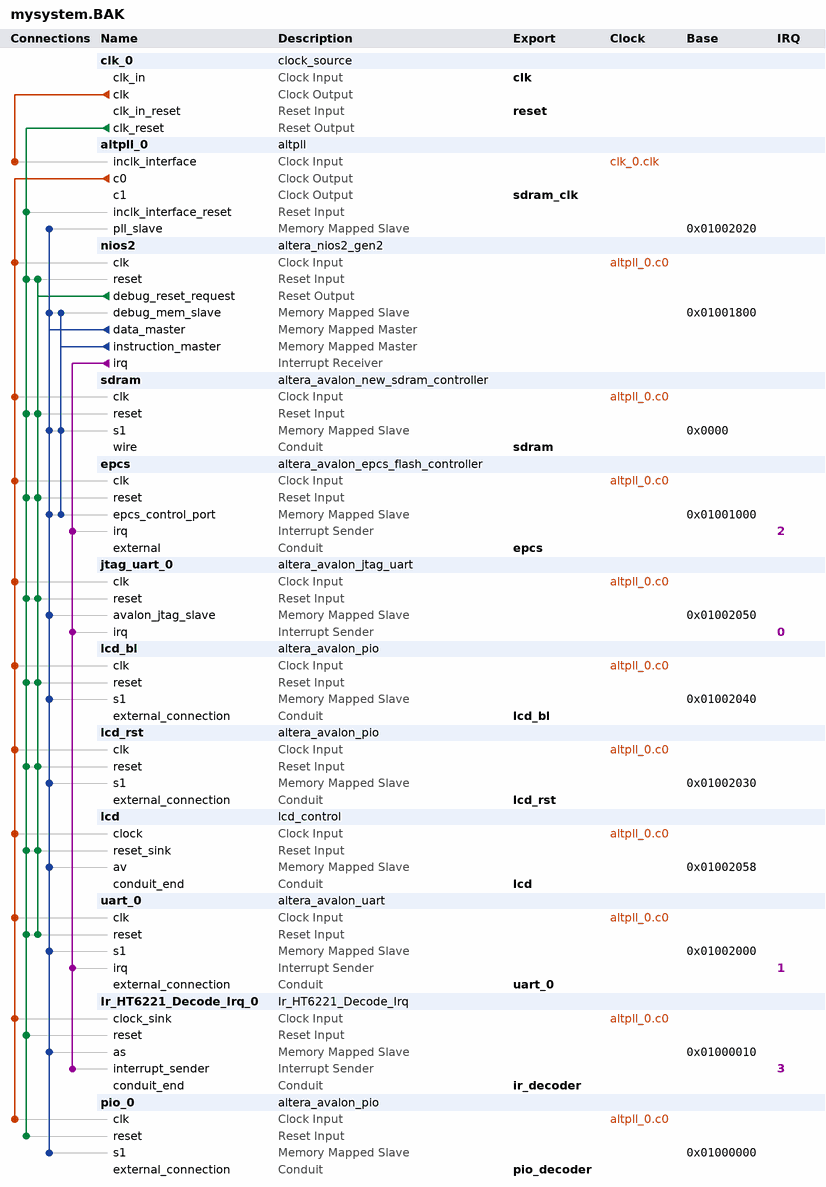
[diagram p0: system contents]
# Platform Designer (Qsys) system mysystem.BAK, Cyclone IV E EP4CE10F17C8
# Parameters at their usual value, and those the tool derives, are not listed.
package require -exact qsys 17.1
create_system mysystem.BAK
set_project_property DEVICE_FAMILY {Cyclone IV E}
set_project_property DEVICE EP4CE10F17C8

add_instance clk_0 clock_source 17.1
set_instance_parameter_value clk_0 clockFrequency 50000000

add_instance altpll_0 altpll 17.1
set_instance_parameter_value altpll_0 CLK0_DIVIDE_BY 1
set_instance_parameter_value altpll_0 CLK0_MULTIPLY_BY 2
set_instance_parameter_value altpll_0 CLK1_DIVIDE_BY 1
set_instance_parameter_value altpll_0 CLK1_DUTY_CYCLE 50
set_instance_parameter_value altpll_0 CLK1_MULTIPLY_BY 2
set_instance_parameter_value altpll_0 CLK1_PHASE_SHIFT -2500
set_instance_parameter_value altpll_0 INCLK0_INPUT_FREQUENCY 20000
set_instance_parameter_value altpll_0 PORT_ARESET PORT_UNUSED
set_instance_parameter_value altpll_0 PORT_LOCKED PORT_UNUSED
set_instance_parameter_value altpll_0 PORT_clk1 PORT_USED
set_instance_parameter_value altpll_0 PORT_clk2 PORT_UNUSED
set_instance_parameter_value altpll_0 PORT_clk3 PORT_UNUSED

add_instance nios2 altera_nios2_gen2 17.1
set_instance_parameter_value nios2 dcache_size 2048
set_instance_parameter_value nios2 exceptionSlave sdram.s1
set_instance_parameter_value nios2 icache_size 4096
set_instance_parameter_value nios2 impl Fast
set_instance_parameter_value nios2 resetSlave epcs.epcs_control_port
set_instance_parameter_value nios2 setting_activateTrace true

add_instance sdram altera_avalon_new_sdram_controller 17.1
set_instance_parameter_value sdram TAC 5.5
set_instance_parameter_value sdram TRCD 20.0
set_instance_parameter_value sdram TRP 20.0
set_instance_parameter_value sdram casLatency 3
set_instance_parameter_value sdram columnWidth 9
set_instance_parameter_value sdram dataWidth 16
set_instance_parameter_value sdram generateSimulationModel false
set_instance_parameter_value sdram model single_Micron_MT48LC4M32B2_7_chip
set_instance_parameter_value sdram numberOfBanks 4
set_instance_parameter_value sdram numberOfChipSelects 1
set_instance_parameter_value sdram powerUpDelay 100.0
set_instance_parameter_value sdram refreshPeriod 15.625
set_instance_parameter_value sdram rowWidth 12

add_instance epcs altera_avalon_epcs_flash_controller 17.1
set_instance_parameter_value epcs resetrequest_enabled true

add_instance jtag_uart_0 altera_avalon_jtag_uart 17.1
set_instance_parameter_value jtag_uart_0 simInteractiveOptions NO_INTERACTIVE_WINDOWS

add_instance lcd_bl altera_avalon_pio 17.1
set_instance_parameter_value lcd_bl direction Output
set_instance_parameter_value lcd_bl resetValue 1
set_instance_parameter_value lcd_bl width 1

add_instance lcd_rst altera_avalon_pio 17.1
set_instance_parameter_value lcd_rst direction Output
set_instance_parameter_value lcd_rst resetValue 1
set_instance_parameter_value lcd_rst width 1

add_instance lcd lcd_control 1.0

add_instance uart_0 altera_avalon_uart 17.1
set_instance_parameter_value uart_0 baud 115200
set_instance_parameter_value uart_0 dataBits 8
set_instance_parameter_value uart_0 fixedBaud false
set_instance_parameter_value uart_0 parity NONE
set_instance_parameter_value uart_0 stopBits 1

add_instance Ir_HT6221_Decode_Irq_0 Ir_HT6221_Decode_Irq 1.0
set_instance_parameter_value Ir_HT6221_Decode_Irq_0 N_Code 32
set_instance_parameter_value Ir_HT6221_Decode_Irq_0 N_Dev 20
set_instance_parameter_value Ir_HT6221_Decode_Irq_0 T_Clk50m 10
set_instance_parameter_value Ir_HT6221_Decode_Irq_0 T_Sa_Clk 10000

add_instance pio_0 altera_avalon_pio 17.1
set_instance_parameter_value pio_0 direction Input
set_instance_parameter_value pio_0 width 32

# connections
add_connection altpll_0.c0 epcs.clk clock
add_connection altpll_0.c0 Ir_HT6221_Decode_Irq_0.clock_sink clock
add_connection altpll_0.c0 jtag_uart_0.clk clock
add_connection altpll_0.c0 lcd.clock clock
add_connection altpll_0.c0 lcd_bl.clk clock
add_connection altpll_0.c0 lcd_rst.clk clock
add_connection altpll_0.c0 nios2.clk clock
add_connection altpll_0.c0 pio_0.clk clock
add_connection altpll_0.c0 sdram.clk clock
add_connection altpll_0.c0 uart_0.clk clock
add_connection clk_0.clk altpll_0.inclk_interface clock
add_connection clk_0.clk_reset altpll_0.inclk_interface_reset reset
add_connection clk_0.clk_reset epcs.reset reset
add_connection clk_0.clk_reset Ir_HT6221_Decode_Irq_0.reset reset
add_connection clk_0.clk_reset jtag_uart_0.reset reset
add_connection clk_0.clk_reset lcd.reset_sink reset
add_connection clk_0.clk_reset lcd_bl.reset reset
add_connection clk_0.clk_reset lcd_rst.reset reset
add_connection clk_0.clk_reset nios2.reset reset
add_connection clk_0.clk_reset pio_0.reset reset
add_connection clk_0.clk_reset sdram.reset reset
add_connection clk_0.clk_reset uart_0.reset reset
add_connection nios2.debug_reset_request epcs.reset reset
add_connection nios2.debug_reset_request jtag_uart_0.reset reset
add_connection nios2.debug_reset_request lcd.reset_sink reset
add_connection nios2.debug_reset_request lcd_bl.reset reset
add_connection nios2.debug_reset_request lcd_rst.reset reset
add_connection nios2.debug_reset_request nios2.reset reset
add_connection nios2.debug_reset_request sdram.reset reset
add_connection nios2.debug_reset_request uart_0.reset reset
add_connection nios2.data_master altpll_0.pll_slave avalon
set_connection_parameter_value nios2.data_master/altpll_0.pll_slave baseAddress 0x01002020
add_connection nios2.data_master epcs.epcs_control_port avalon
set_connection_parameter_value nios2.data_master/epcs.epcs_control_port baseAddress 0x01001000
add_connection nios2.data_master Ir_HT6221_Decode_Irq_0.as avalon
set_connection_parameter_value nios2.data_master/Ir_HT6221_Decode_Irq_0.as baseAddress 0x01000010
add_connection nios2.data_master jtag_uart_0.avalon_jtag_slave avalon
set_connection_parameter_value nios2.data_master/jtag_uart_0.avalon_jtag_slave baseAddress 0x01002050
add_connection nios2.data_master lcd.av avalon
set_connection_parameter_value nios2.data_master/lcd.av baseAddress 0x01002058
add_connection nios2.data_master lcd_bl.s1 avalon
set_connection_parameter_value nios2.data_master/lcd_bl.s1 baseAddress 0x01002040
add_connection nios2.data_master lcd_rst.s1 avalon
set_connection_parameter_value nios2.data_master/lcd_rst.s1 baseAddress 0x01002030
add_connection nios2.data_master nios2.debug_mem_slave avalon
set_connection_parameter_value nios2.data_master/nios2.debug_mem_slave baseAddress 0x01001800
add_connection nios2.data_master pio_0.s1 avalon
set_connection_parameter_value nios2.data_master/pio_0.s1 baseAddress 0x01000000
add_connection nios2.data_master sdram.s1 avalon
set_connection_parameter_value nios2.data_master/sdram.s1 baseAddress 0x0000
add_connection nios2.data_master uart_0.s1 avalon
set_connection_parameter_value nios2.data_master/uart_0.s1 baseAddress 0x01002000
add_connection nios2.instruction_master epcs.epcs_control_port avalon
set_connection_parameter_value nios2.instruction_master/epcs.epcs_control_port baseAddress 0x01001000
add_connection nios2.instruction_master nios2.debug_mem_slave avalon
set_connection_parameter_value nios2.instruction_master/nios2.debug_mem_slave baseAddress 0x01001800
add_connection nios2.instruction_master sdram.s1 avalon
set_connection_parameter_value nios2.instruction_master/sdram.s1 baseAddress 0x0000
add_connection nios2.irq epcs.irq interrupt
set_connection_parameter_value nios2.irq/epcs.irq irqNumber 2
add_connection nios2.irq Ir_HT6221_Decode_Irq_0.interrupt_sender interrupt
set_connection_parameter_value nios2.irq/Ir_HT6221_Decode_Irq_0.interrupt_sender irqNumber 3
add_connection nios2.irq jtag_uart_0.irq interrupt
set_connection_parameter_value nios2.irq/jtag_uart_0.irq irqNumber 0
add_connection nios2.irq uart_0.irq interrupt
set_connection_parameter_value nios2.irq/uart_0.irq irqNumber 1

# exported interfaces
add_interface clk clock sink
set_interface_property clk EXPORT_OF clk_0.clk_in
add_interface epcs conduit end
set_interface_property epcs EXPORT_OF epcs.external
add_interface ir_decoder conduit end
set_interface_property ir_decoder EXPORT_OF Ir_HT6221_Decode_Irq_0.conduit_end
add_interface lcd conduit end
set_interface_property lcd EXPORT_OF lcd.conduit_end
add_interface lcd_bl conduit end
set_interface_property lcd_bl EXPORT_OF lcd_bl.external_connection
add_interface lcd_rst conduit end
set_interface_property lcd_rst EXPORT_OF lcd_rst.external_connection
add_interface pio_decoder conduit end
set_interface_property pio_decoder EXPORT_OF pio_0.external_connection
add_interface reset reset sink
set_interface_property reset EXPORT_OF clk_0.clk_in_reset
add_interface sdram conduit end
set_interface_property sdram EXPORT_OF sdram.wire
add_interface sdram_clk clock source
set_interface_property sdram_clk EXPORT_OF altpll_0.c1
add_interface uart_0 conduit end
set_interface_property uart_0 EXPORT_OF uart_0.external_connection

set_interconnect_requirement {$system} qsys_mm.clockCrossingAdapter HANDSHAKE
set_interconnect_requirement {$system} qsys_mm.enableEccProtection FALSE
set_interconnect_requirement {$system} qsys_mm.insertDefaultSlave FALSE
set_interconnect_requirement {$system} qsys_mm.maxAdditionalLatency 1

save_system mysystem.BAK.qsys
